# Altium project SaraKit_CameraHub.PrjPcb
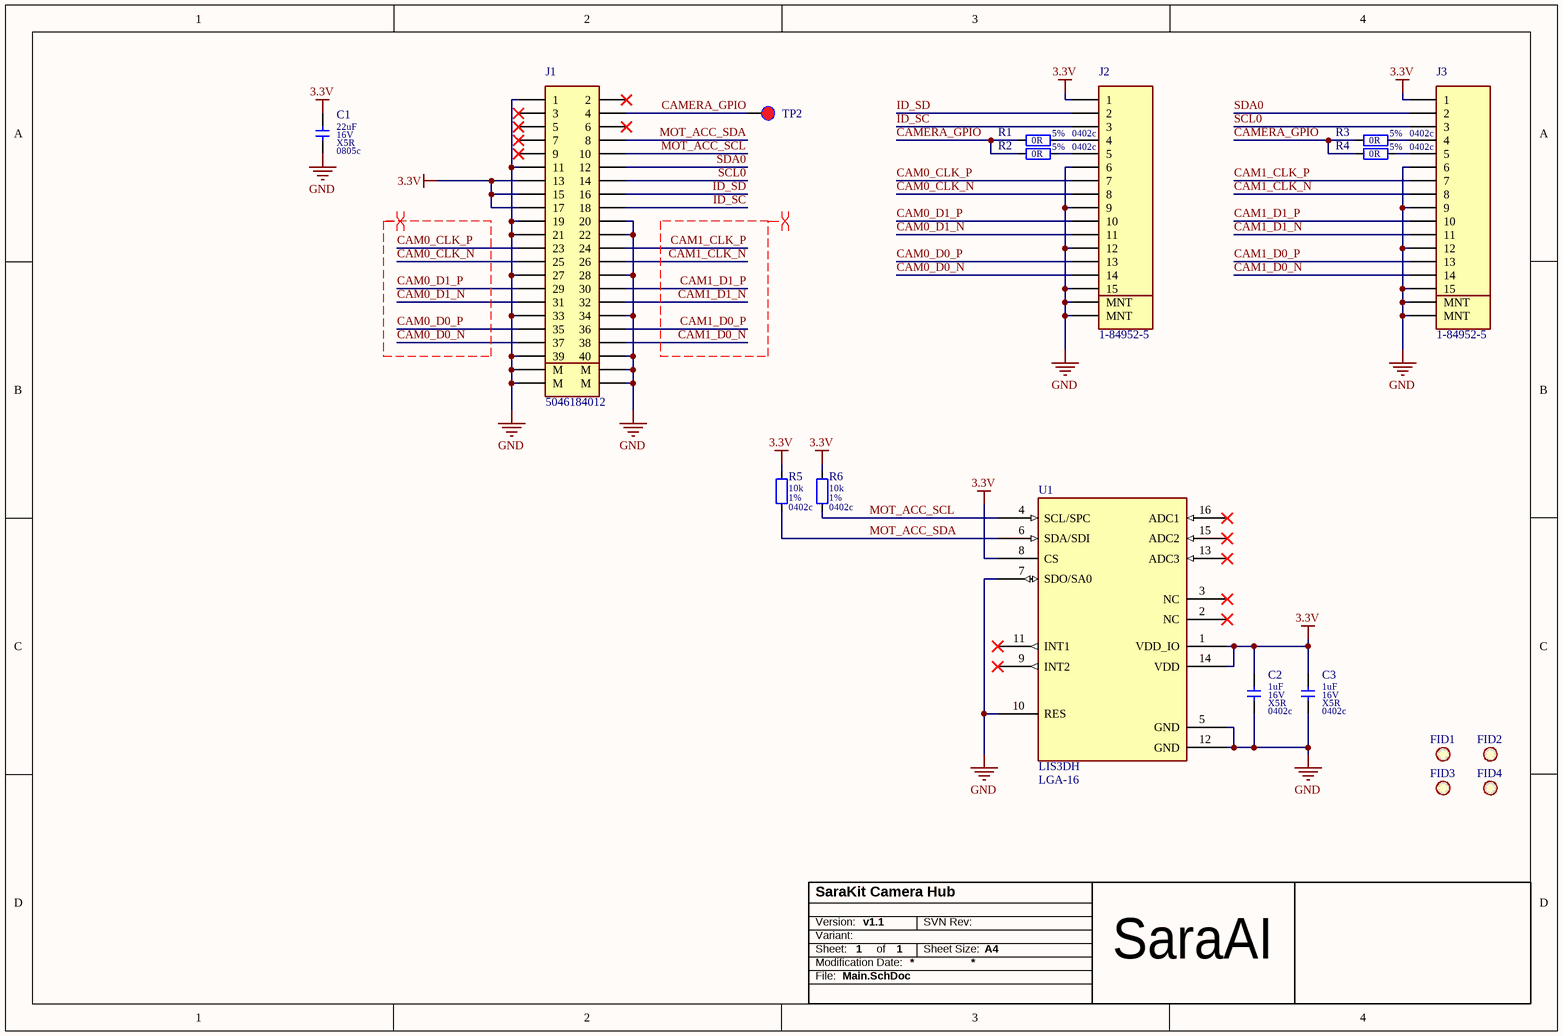
[diagram p0: Main.SchDoc]
Version: v1.1; Project_code: SaraKit Camera Hub
1 sheet, 18 parts. Net scope: global (net labels, ports and power ports of the same name join across sheets).
Board file: pcb.PcbDoc

## Sheet Main.SchDoc
size A4; SheetNumber: 1; SheetTotal: 1

### Parts
C1  11 Parameter 4: X5R  07 Package: 0805c  08 Parameter 1: 22uF  09 Parameter 2: 16V  [CAPC2013X145L]  (hidden comment: CL21A226MOQNNNE)
C2  11 Parameter 4: X5R  07 Package: 0402c  08 Parameter 1: 1uF  09 Parameter 2: 16V  [CAPC1005X60L]  (hidden comment: CL05A105KO5NNNC)
C3  11 Parameter 4: X5R  07 Package: 0402c  08 Parameter 1: 1uF  09 Parameter 2: 16V  [CAPC1005X60L]  (hidden comment: CL05A105KO5NNNC)
FID1  FIDUCIAL  [FIDUCIAL 2MM]  (value not drawn)  (no BOM)
FID2  FIDUCIAL  [FIDUCIAL 2MM]  (value not drawn)  (no BOM)
FID3  FIDUCIAL  [FIDUCIAL 2MM]  (value not drawn)  (no BOM)
FID4  FIDUCIAL  [FIDUCIAL 2MM]  (value not drawn)  (no BOM)
J1  5046184012  [MOLEX 5046184012]
J2  1-84952-5  [TE 1-84952-5]
J3  1-84952-5  [TE 1-84952-5]
R1  07 Package: 0402c  09 Parameter 2: 5%  08 Parameter 1: 0R  [RESC1005X40L]  (hidden comment: RC0402JR-070RL)
R2  07 Package: 0402c  09 Parameter 2: 5%  08 Parameter 1: 0R  [RESC1005X40L]  (hidden comment: RC0402JR-070RL)
R3  07 Package: 0402c  09 Parameter 2: 5%  08 Parameter 1: 0R  [RESC1005X40L]  (hidden comment: RC0402JR-070RL)
R4  07 Package: 0402c  09 Parameter 2: 5%  08 Parameter 1: 0R  [RESC1005X40L]  (hidden comment: RC0402JR-070RL)
R5  07 Package: 0402c  09 Parameter 2: 1%  08 Parameter 1: 10k  [RESC1005X40L]  (hidden comment: RC0402FR-0710KL)
R6  07 Package: 0402c  09 Parameter 2: 1%  08 Parameter 1: 10k  [RESC1005X40L]  (hidden comment: RC0402FR-0710KL)
TP2  TESTPAD  [TP 1.5mm]  (value not drawn)  (no BOM)
U1  07 Package: LGA-16  [LGA16R50P5X3_300X300X100]  (hidden comment: LIS3DH)

### Nets
3.3V: C1.2 C2.2 C3.2 J1.13 J1.15 J1.17 J2.1 J3.1 R5.2 R6.2 U1.1(VDD_IO) U1.8(CS) U1.14(VDD)
GND: C1.1 C2.1 C3.1 J1.1 J1.11 J1.19 J1.20 J1.21 J1.22 J1.27 J1.28 J1.33 J1.34 J1.39 J1.40 J1.MNT1(M) J1.MNT2(M) J1.MNT3(M) J1.MNT4(M) J2.6 J2.9 J2.12 J2.15 J2.MNT1(MNT) J2.MNT2(MNT) J3.6 J3.9 J3.12 J3.15 J3.MNT1(MNT) J3.MNT2(MNT) U1.5(GND) U1.7(SDO/SA0) U1.10(RES) U1.12(GND)
CAM0_CLK_N: J1.25 J2.8
CAM0_CLK_P: J1.23 J2.7
CAM0_D0_N: J1.37 J2.14
CAM0_D0_P: J1.35 J2.13
CAM0_D1_N: J1.31 J2.11
CAM0_D1_P: J1.29 J2.10
CAM1_CLK_N: J1.26 J3.8
CAM1_CLK_P: J1.24 J3.7
CAM1_D0_N: J1.38 J3.14
CAM1_D0_P: J1.36 J3.13
CAM1_D1_N: J1.32 J3.11
CAM1_D1_P: J1.30 J3.10
CAMERA_GPIO: J1.4 R1.1 R2.1 R3.1 R4.1 TP2.1
ID_SC: J1.18 J2.3
ID_SD: J1.16 J2.2
MOT_ACC_SCL: J1.10 R6.1 U1.4(SCL/SPC)
MOT_ACC_SDA: J1.8 R5.1 U1.6(SDA/SDI)
SCL0: J1.14 J3.3
SDA0: J1.12 J3.2
NetJ2_4: J2.4 R1.2
NetJ2_5: J2.5 R2.2
NetJ3_4: J3.4 R3.2
NetJ3_5: J3.5 R4.2

Not connected (* = marked no-connect by the designer): J1 2* 3* 5* 6* 7* 9*; U1 2(NC)* 3(NC)* 9(INT2)* 11(INT1)* 13(ADC3)* 15(ADC2)* 16(ADC1)*

### Layout directives
differential pair; differential pair class 100ohm_diff; differential pair class CAM1_diff: CAM0_CLK_N, CAM0_CLK_P, CAM0_D0_N, CAM0_D0_P, CAM0_D1_N, CAM0_D1_P
differential pair; differential pair class 100ohm_diff; differential pair class CAM0_diff: CAM1_CLK_N, CAM1_CLK_P, CAM1_D0_N, CAM1_D0_P, CAM1_D1_N, CAM1_D1_P

### Notes on the sheet
- Version:
- SVN Rev:
- Sheet:
- File:
- Modification Date:
- Variant:
- of
- Sheet Size:
- A4
- SaraAI

### Library data of the parts
C1 = 81: SMT 0805c 22uF 16V 20% X5R 1.6MHz 85'C; 03 Manufacturer: Samsung; 00 Index: 81; 01 Name: CAPACITOR CERAMIC CL21A226MOQNNNE Samsung; 05 Sub Group: CERAMIC; 04 Main Group: CAPACITOR; 06 Assembly: SMT; 12 Parameter 5: 1.6MHz; 13 Parameter 6: 85'C; 14 Modification Date: 16.11.2020; ComponentLink1Description: DATASHEET; ComponentLink1URL: E:\Praca\Mindsailors\Mindsailors Altium\Database Library\Datasheets\CAPACITOR\Samsung CL21A226MOQNNN.pdf; 02 MPN: CL21A226MOQNNNE; 10 Parameter 3: 20%
C2 C3 = 155: SMT 0402c 1uF 16V 10% X5R 11.9MHz 85'C; 03 Manufacturer: Samsung; 00 Index: 155; 01 Name: CAPACITOR THICK FILM CL05A105KO5NNNC Samsung; 05 Sub Group: THICK FILM; 04 Main Group: CAPACITOR; 06 Assembly: SMT; 12 Parameter 5: 11.9MHz; 13 Parameter 6: 85'C; 14 Modification Date: 16.11.2020; ComponentLink1Description: DATASHEET; ComponentLink1URL: E:\Praca\Mindsailors\Mindsailors Altium\Database Library\Datasheets\CAPACITOR\Samsung CL05A105KO5NNN.pdf; 02 MPN: CL05A105KO5NNNC; 10 Parameter 3: 10%
FID1-FID4 = 487: 00 Index: 487; Library Directory: sym_basics/; Fotprint Directory: fot_other/; 01 Name: FIDUCIAL; 14 Modification Date: 23.02.2021; 02 MPN: FIDUCIAL; 07 Package: *
J1 = 509: SMT 2x20 0.35mm Straight 50V 0.3A; 03 Manufacturer: Molex; 00 Index: 509; 01 Name: CONNECTOR PCB 5046184012 Molex; 04 Main Group: CONNECTOR; 05 Sub Group: PCB; 06 Assembly: SMT; 13 Parameter 6: 0.3A; 14 Modification Date: 18.03.2021; ComponentLink1Description: DATASHEET; ComponentLink1URL: https://www.molex.com/molex/products/part-detail/pcb_receptacles/5046183012; 09 Parameter 2: 0.35mm; 08 Parameter 1: 2x20; 11 Parameter 4: Straight; 12 Parameter 5: 50V; 07 Package: *; 02 MPN: 5046184012
J2 J3 = 1028: SMT 1x15 1mm Bottom Contact Right Angle 200VAC 1A; 03 Manufacturer: TE Connectivity; 00 Index: 1028; 01 Name: CONNECTOR PCB 1-84952-5 TE Connectivity; 04 Main Group: CONNECTOR; 05 Sub Group: PCB; Library Directory: sym_basics/; Fotprint Directory: fot_other/; 06 Assembly: SMT; 13 Parameter 6: 1A; 14 Modification Date: 22.06.2022; ComponentLink1Description: DATASHEET; ComponentLink1URL: https://www.te.com/usa-en/product-1-84952-5.html; 10 Parameter 3: Bottom Contact; 09 Parameter 2: 1mm; 08 Parameter 1: 1x15; 11 Parameter 4: Right Angle; 12 Parameter 5: 200VAC; 07 Package: *; 02 MPN: 1-84952-5
R1-R4 = 14: SMT 0402c 0R 5% 62.5mW 200ppm/K 50V; 03 Manufacturer: Yageo; 00 Index: 14; 01 Name: RESISTOR THICK FILM RC0402JR-070RL Yageo; 05 Sub Group: THICK FILM; 04 Main Group: RESISTOR; 06 Assembly: SMT; 11 Parameter 4: 200ppm/K; 12 Parameter 5: 50V; 14 Modification Date: 16.11.2020; ComponentLink1Description: DATASHEET; ComponentLink1URL: E:\Praca\Mindsailors\Mindsailors Altium\Database Library\Datasheets\RESISTOR\Yageo RC_L Series.pdf; 10 Parameter 3: 62.5mW; 02 MPN: RC0402JR-070RL
R5 R6 = 15: SMT 0402c 10k 1% 62.5mW 100ppm/K 50V; 03 Manufacturer: Yageo; 00 Index: 15; 01 Name: RESISTOR THICK FILM RC0402FR-0710KL Yageo; 05 Sub Group: THICK FILM; Library Directory: sym_basics/; Fotprint Directory: fot_ipc/; 04 Main Group: RESISTOR; 06 Assembly: SMT; 11 Parameter 4: 100ppm/K; 12 Parameter 5: 50V; 14 Modification Date: 16.11.2020; ComponentLink1Description: DATASHEET; ComponentLink1URL: E:\Praca\Mindsailors\Mindsailors Altium\Database Library\Datasheets\RESISTOR\Yageo RC_L Series.pdf; 10 Parameter 3: 62.5mW; 02 MPN: RC0402FR-0710KL
TP2 = 10: 00 Index: 10; 01 Name: PCB COMPONENT TESTPAD TESTPAD; 04 Main Group: PCB COMPONENT; 02 MPN: TESTPAD; 05 Sub Group: TESTPAD; 14 Modification Date: 16.11.2020
U1 = 158: SMT LGA-16 ACCELEROMETER 1.71V - 3.6V +/- 16g; 03 Manufacturer: STMicroelectronics; 00 Index: 158; 01 Name: IC SENSOR LIS3DH STMicroelectronics; 04 Main Group: IC; 05 Sub Group: SENSOR; 12 Parameter 5: +/- 16g; 06 Assembly: SMT; 11 Parameter 4: 1.71V - 3.6V; 14 Modification Date: 18.12.2020; ComponentLink1Description: DATASHEET; ComponentLink1URL: E:\Praca\Mindsailors\Mindsailors Altium\Database Library\Datasheets\IC\ST lis3dh.pdf; 08 Parameter 1: ACCELEROMETER; 02 MPN: LIS3DH

## Assembly variants
Standard: not fitted C?